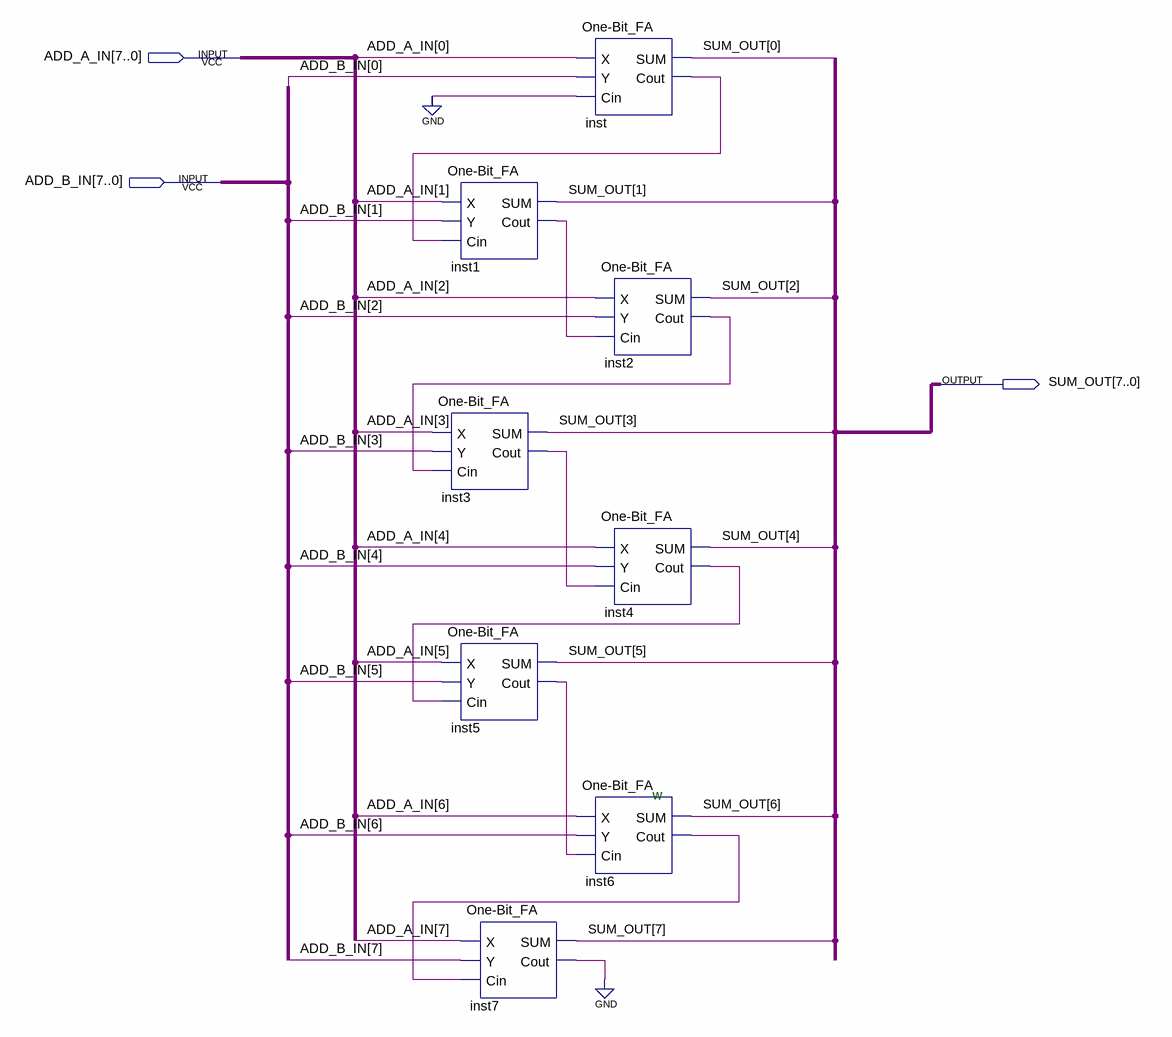
[diagram p0: schematic sheet]
// Quartus schematic ADDER.bdf as structural Verilog: 8 symbols, 3 pins
module ADDER (
  input  [7:0] ADD_A_IN,
  input  [7:0] ADD_B_IN,
  output [7:0] SUM_OUT
);

  wire inst1_cout, inst2_cout, inst3_cout, inst4_cout, inst5_cout, inst6_cout, inst7_cout, inst_cout;

  \One-Bit_FA  inst1 (.X(ADD_A_IN[1]), .Y(ADD_B_IN[1]), .Cin(inst_cout), .SUM(SUM_OUT[1]), .Cout(inst1_cout));
  \One-Bit_FA  inst3 (.X(ADD_A_IN[3]), .Y(ADD_B_IN[3]), .Cin(inst2_cout), .SUM(SUM_OUT[3]), .Cout(inst3_cout));
  \One-Bit_FA  inst5 (.X(ADD_A_IN[5]), .Y(ADD_B_IN[5]), .Cin(inst4_cout), .SUM(SUM_OUT[5]), .Cout(inst5_cout));
  \One-Bit_FA  inst7 (.X(ADD_A_IN[7]), .Y(ADD_B_IN[7]), .Cin(inst6_cout), .SUM(SUM_OUT[7]), .Cout(inst7_cout));
  \One-Bit_FA  inst (.X(ADD_A_IN[0]), .Y(ADD_B_IN[0]), .Cin(1'b0), .SUM(SUM_OUT[0]), .Cout(inst_cout));
  \One-Bit_FA  inst2 (.X(ADD_A_IN[2]), .Y(ADD_B_IN[2]), .Cin(inst1_cout), .SUM(SUM_OUT[2]), .Cout(inst2_cout));
  \One-Bit_FA  inst4 (.X(ADD_A_IN[4]), .Y(ADD_B_IN[4]), .Cin(inst3_cout), .SUM(SUM_OUT[4]), .Cout(inst4_cout));
  \One-Bit_FA  inst6 (.X(ADD_A_IN[6]), .Y(ADD_B_IN[6]), .Cin(inst5_cout), .SUM(SUM_OUT[6]), .Cout(inst6_cout));
  // also tied to GND on the sheet: inst7_cout

  // Notes on the sheet:
  //   w
endmodule
